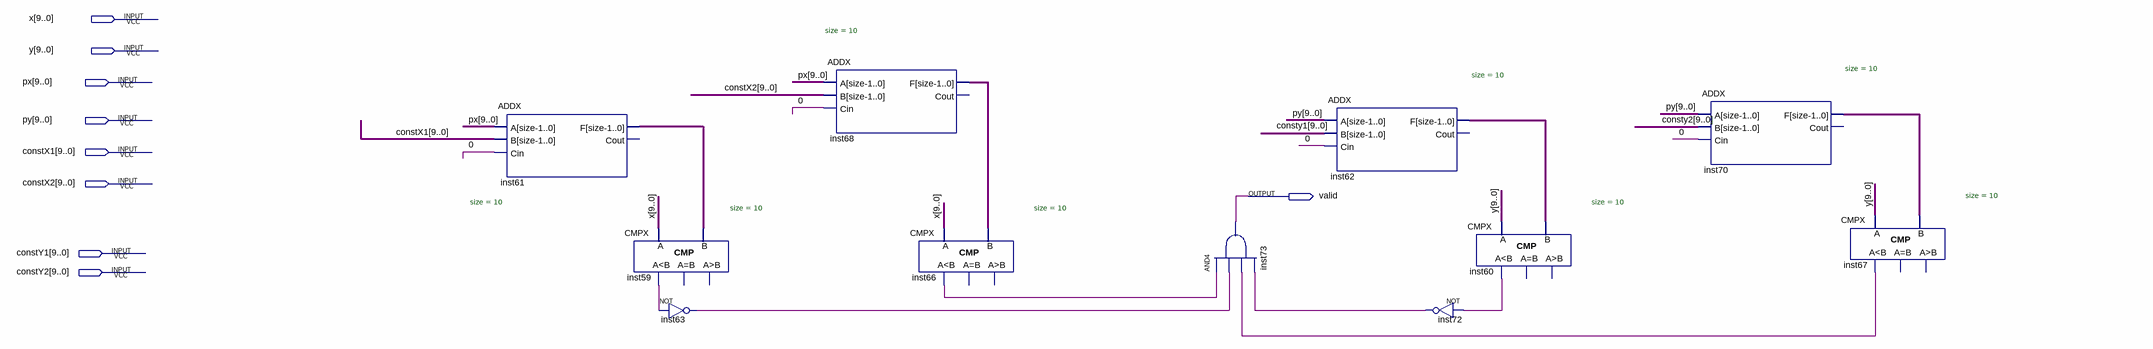
[diagram p0: schematic sheet]
// Quartus schematic kvadrat.bdf as structural Verilog: 11 symbols, 9 pins
module kvadrat (
  input  [9:0] x,
  input  [9:0] y,
  input  [9:0] px,
  input  [9:0] py,
  input  [9:0] constX1,
  input  [9:0] constX2,
  input  [9:0] constY1,
  input  [9:0] constY2,
  output valid
);

  wire \0 , inst59_ls, inst60_ls, inst63_out, inst66_ls, inst67_ls, inst72_out;
  wire [9:0] inst61_f, inst62_f, inst68_f, inst70_f;

  ADDX #(.size(10)) inst61 (.A(px), .B(constX1), .Cin(\0 ), .F(inst61_f));  // open: Cout
  CMPX #(.size(10)) inst59 (.A(x), .B(inst61_f), .ls(inst59_ls));  // open: eq, gr
  not inst63 (inst63_out, inst59_ls);
  ADDX #(.size(10)) inst68 (.A(px), .B(constX2), .Cin(\0 ), .F(inst68_f));  // open: Cout
  CMPX #(.size(10)) inst66 (.A(x), .B(inst68_f), .ls(inst66_ls));  // open: eq, gr
  and inst73 (valid, inst66_ls, inst63_out, inst67_ls, inst72_out);
  ADDX #(.size(10)) inst62 (.A(py), .B(constY1), .Cin(\0 ), .F(inst62_f));  // open: Cout
  not inst72 (inst72_out, inst60_ls);
  CMPX #(.size(10)) inst60 (.A(y), .B(inst62_f), .ls(inst60_ls));  // open: eq, gr
  ADDX #(.size(10)) inst70 (.A(py), .B(constY2), .Cin(\0 ), .F(inst70_f));  // open: Cout
  CMPX #(.size(10)) inst67 (.A(y), .B(inst70_f), .ls(inst67_ls));  // open: eq, gr
endmodule
